# EAGLE design TinyBlinkRGB (EAGLE 7.7.0)
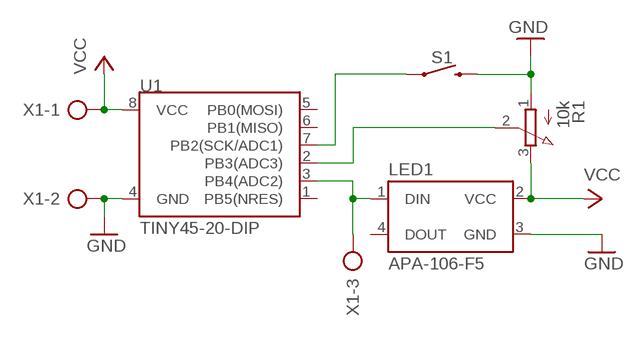
[diagram p0: schematic, sheet 1]

## Parts
LED1  APA-106-F5  [APA-106-F5]
R1  10k  3RP/1610N  [3RP/1610N]
S1  MOMENTARY-SWITCH-SPST-PTH-6.0MM  [TACTILE_SWITCH_PTH_6.0MM]
U1  TINY45-20-DIP  ATTINY45TINY45-20-DIP  [DIP08_MCU]
X1  AK500/3  [AK500/3]

## Nets
GND: LED1.3(GND) R1.1(A) S1.3 U1.4(GND) X1.2
N$1: LED1.1(DIN) U1.3(PB4(ADC2)) X1.3
N$2: R1.2(S) U1.2(PB3(ADC3))
N$3: S1.1 U1.7(PB2(SCK/ADC1))
VCC: LED1.2(VCC) R1.3(E) U1.8(VCC) X1.1
Unconnected: LED1.4(DOUT) U1.1(PB5(NRES)) U1.5(PB0(MOSI)) U1.6(PB1(MISO))

## Library data of the parts
LED1 = yellowk:APA-106
R1 = pot:3RP/1610N: 16mm Potentiometer one level Source: http://www.alphapotentiometers.net/html/16mm_pot_2.html
S1 = SparkFun-Switches:MOMENTARY-SWITCH-SPST: Momentary Switch (Pushbutton) - SPST Normally-open (NO) SPST momentary switches (buttons, pushbuttons). Variants PTH-12MM - 12mm square, through-hole Momentary Pushbutton Switch - 12mm Square <https://www.sparkfun.com/products/9190> (COM-09190) PTH-6.0MM, PTH-6.0MM-KIT - 6.0mm square, through-hole Mini Pushbutton Switch <https://www.sparkfun.com/products/97> (COM-00097) KIT package intended for soldering kit's - only one side of pads' copper is exposed. PTH-RIGHT-ANGLE-KIT - Right-angle, through-hole Right Angle Tactile Button <https://www.sparkfun.com/products/10791> - Used on SparkFun BigTime Watch Kit <https://www.sparkfun.com/products/11734> SMD-12MM - 12mm square, surface-mount Tactile Button - SMD (12mm) <https://www.sparkfun.com/products/12993> (COM-12993) Used on SparkFun PicoBoard <https://www.sparkfun.com/products/11888> SMD-4.5MM - 4.5mm Square Trackball Switch Used on SparkFun Blackberry Trackballer Breakout <https://www.sparkfun.com/products/13169> SMD-4.6MMX2.8MM - 4.60mm x 2.80mm, surface mount Used on SparkFun SAMD21 Mini Breakout <https://www.sparkfun.com/products/13664> SMD-5.2MM, SMD-5.2-REDUNDANT - 5.2mm square, surface-mount Mini Pushbutton Switch - SMD <https://www.sparkfun.com/products/8720> (COM-08720) Used on Arduino Pro Mini <https://www.sparkfun.com/products/11114> REDUNDANT package connects both switch circuits together SMD-6.0X3.5MM - 6.0 x 3.5mm, surface mount Momentary Reset Switch SMD <https://www.sparkfun.com/products/8229> (COM-08229) SMD-6.2MM-TALL - 6.2mm square, surface mount Tactile Button - SMD (6mm) <https://www.sparkfun.com/products/12992> Used on SparkFun Digital Sandbox <https://www.sparkfun.com/products/12651> SMD-RIGHT-ANGLE - Right-angle, surface mount Used on SparkFun Block for Intel® Edison - Arduino <https://www.sparkfun.com/products/13036>; PROD_ID: SWCH-08441; SF_SKU: COM-00097
U1 = SparkFun-Retired:ATTINY45: Atmel 8-pin 2/4/8kB flash uC Retired; PROD_ID: IC-09439
X1 = con-ptr500:AK500/3: CONNECTOR; OC_FARNELL: unknown; OC_NEWARK: unknown

## Board
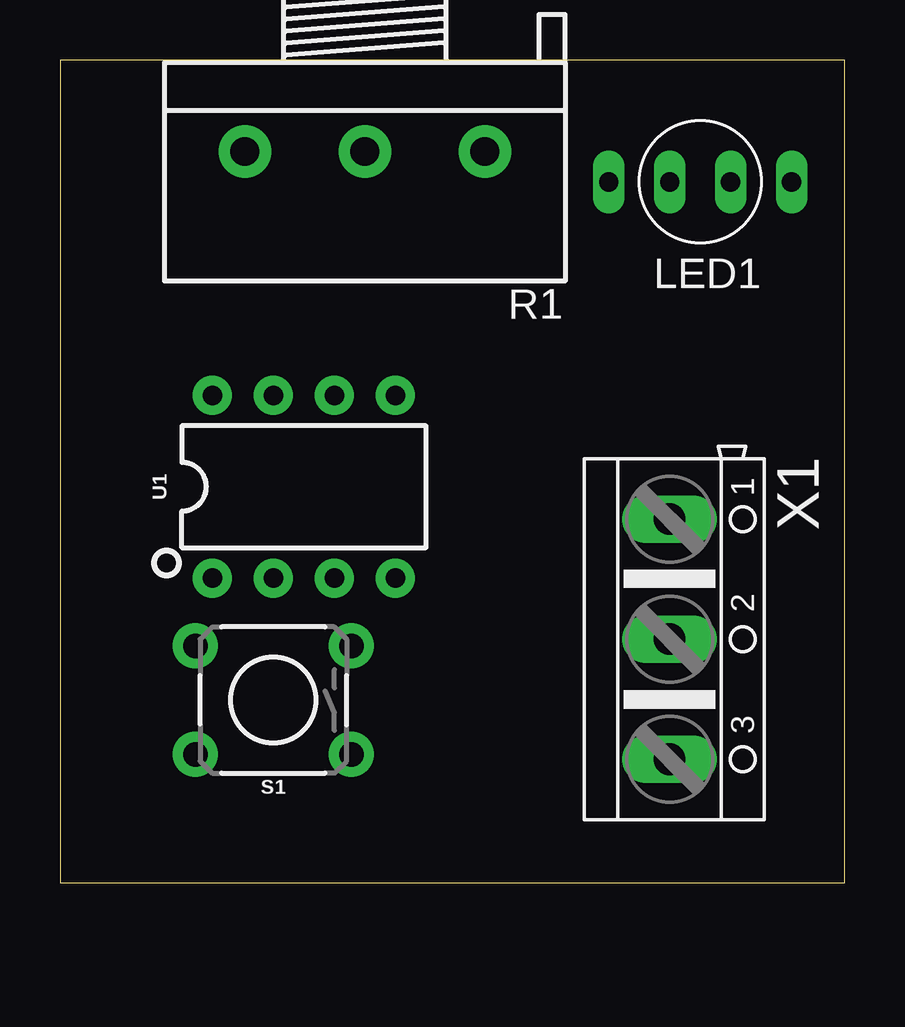
[diagram p1: board, top side]
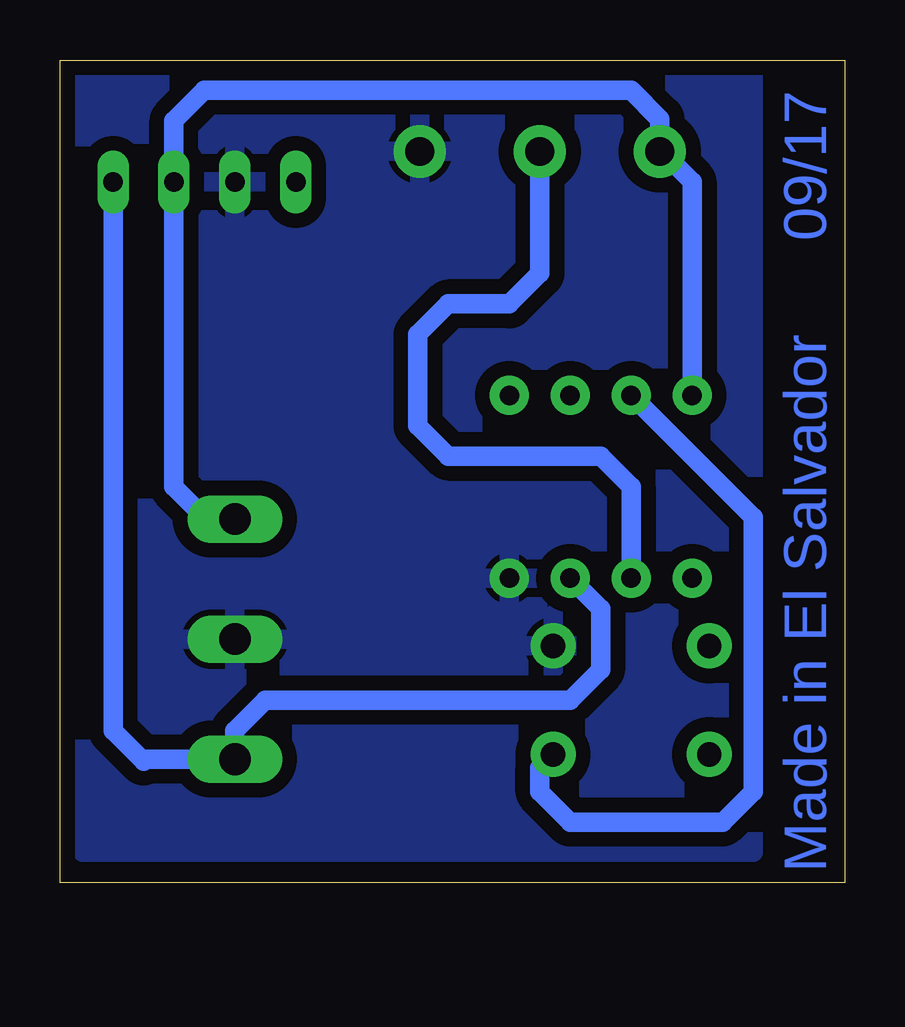
[diagram p2: board, bottom side, seen from below]

Size 32.69 x 34.29 mm. Coordinates in mm from the lower left corner, seen from the top.
Outline: 0,0 32.69,0 32.69,34.28 2.54,34.28 0,34.29 0,0
Copper layers (1*16): Top 0.035mm / dielectric 1.5mm / Bottom 0.035mm
Design rules "default *": minimum track width 32mil, minimum drill 24mil, track to track 12mil, track to pad 12mil, pad to pad 12mil, via to via 12mil, smd to smd 12mil, copper to edge 12mil, drill to drill 8mil, minimum pad ring 10mil, minimum via ring 8mil, stop-mask expansion 4mil, vias tented up to drill 0mil, thermal gap 10mil

### Footprints (pad centres in the part's own frame; a part is rotated, then mirrored left to right if it is on the bottom)
APA-106-F5 = drill 0.8 long: 1 -3.81,0; 2 -1.27,0; 3 1.27,0; 4 3.81,0
3RP/1610N = drill 1.2 pad 2.184: 1 -5,0; 2 0,0; 3 5,0
TACTILE_SWITCH_PTH_6.0MM = drill 1.016 pad 1.88: 1 -3.251,2.261; 2 3.251,2.261; 3 -3.251,-2.261; 4 3.251,-2.261
DIP08_MCU = drill 0.813 pad 1.626: 1 -3.81,-3.81; 2 -1.27,-3.81; 3 1.27,-3.81; 4 3.81,-3.81; 5 3.81,3.81; 6 1.27,3.81; 7 -1.27,3.81; 8 -3.81,3.81
AK500/3 = drill 1.321 long: 1 -5.004,0; 2 0,0; 3 5.004,0

### Placement (x,y rotation side)
LED1  26.67,29.21 180 top
R1  12.7,30.48 180 top
S1  8.89,7.62 180 top
U1  10.16,16.51 0 top
X1  25.4,10.16 270 top

### Tracks (layer width: path | path; a pad name or v marks a point on that pad's centre or on a via)
GND
  Bottom 0.813: 24.13,10.16 X1.2
  pour Bottom (isolate 0.61): 3.81,34.29 3.81,1.27 31.75,1.27 31.75,34.29
N$1
  Bottom 0.813: LED1.1 30.48,6.35 29.21,5.08 29.13,5.16 X1.3 25.4,6.35 24.13,7.62 11.43,7.62 10.16,8.89 10.16,11.43 U1.3
N$2
  Bottom 0.813: R1.2 12.7,25.4 13.97,24.13 16.51,24.13 17.78,22.86 17.78,19.05 16.51,17.78 10.16,17.78 8.89,16.51 U1.2
N$3
  Bottom 0.813: U1.7 3.81,15.24 3.81,3.81 5.08,2.54 11.43,2.54 12.7,3.81 12.7,4.8 S1.1
VCC
  Bottom 0.813: U1.8 6.35,29.21 7.62,30.48 R1.3 7.7,31.83 8.89,33.02 26.67,33.02 27.94,31.75 LED1.2 27.94,16.51 26.67,15.24 25.48,15.24 X1.1

### Text on the board
Bottom: 09/17 | Made in El Salvador